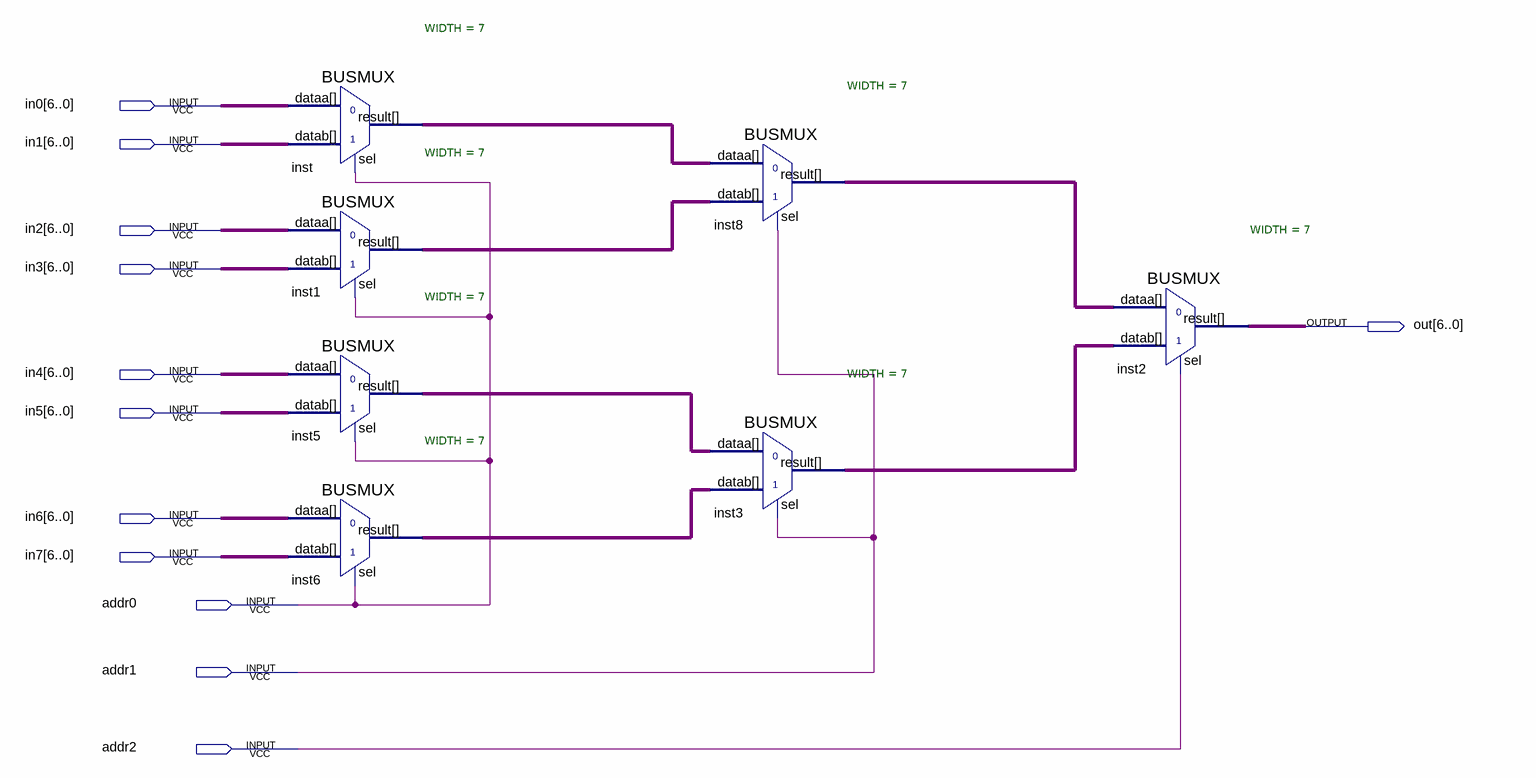
[diagram p0: schematic sheet]
// Quartus schematic bus_muw_7.bdf as structural Verilog: 7 symbols, 12 pins
module bus_muw_7 (
  input  [6:0] in0,
  input  [6:0] in1,
  input  [6:0] in2,
  input  [6:0] in3,
  input  [6:0] in4,
  input  [6:0] in5,
  input  [6:0] in6,
  input  [6:0] in7,
  input  addr0,
  input  addr1,
  input  addr2,
  output [6:0] out
);

  wire [6:0] inst1_result, inst3_result, inst5_result, inst6_result, inst8_result, inst_result;

  BUSMUX #(.WIDTH(7)) inst (.datab(in1), .sel(addr0), .dataa(in0), .result(inst_result));
  BUSMUX #(.WIDTH(7)) inst1 (.datab(in3), .sel(addr0), .dataa(in2), .result(inst1_result));
  BUSMUX #(.WIDTH(7)) inst5 (.datab(in5), .sel(addr0), .dataa(in4), .result(inst5_result));
  BUSMUX #(.WIDTH(7)) inst6 (.datab(in7), .sel(addr0), .dataa(in6), .result(inst6_result));
  BUSMUX #(.WIDTH(7)) inst8 (.datab(inst1_result), .sel(addr1), .dataa(inst_result), .result(inst8_result));
  BUSMUX #(.WIDTH(7)) inst3 (.datab(inst6_result), .sel(addr1), .dataa(inst5_result), .result(inst3_result));
  BUSMUX #(.WIDTH(7)) inst2 (.datab(inst3_result), .sel(addr2), .dataa(inst8_result), .result(out));
endmodule
